# EAGLE design SN65HVD230 (EAGLE 7.2.0)
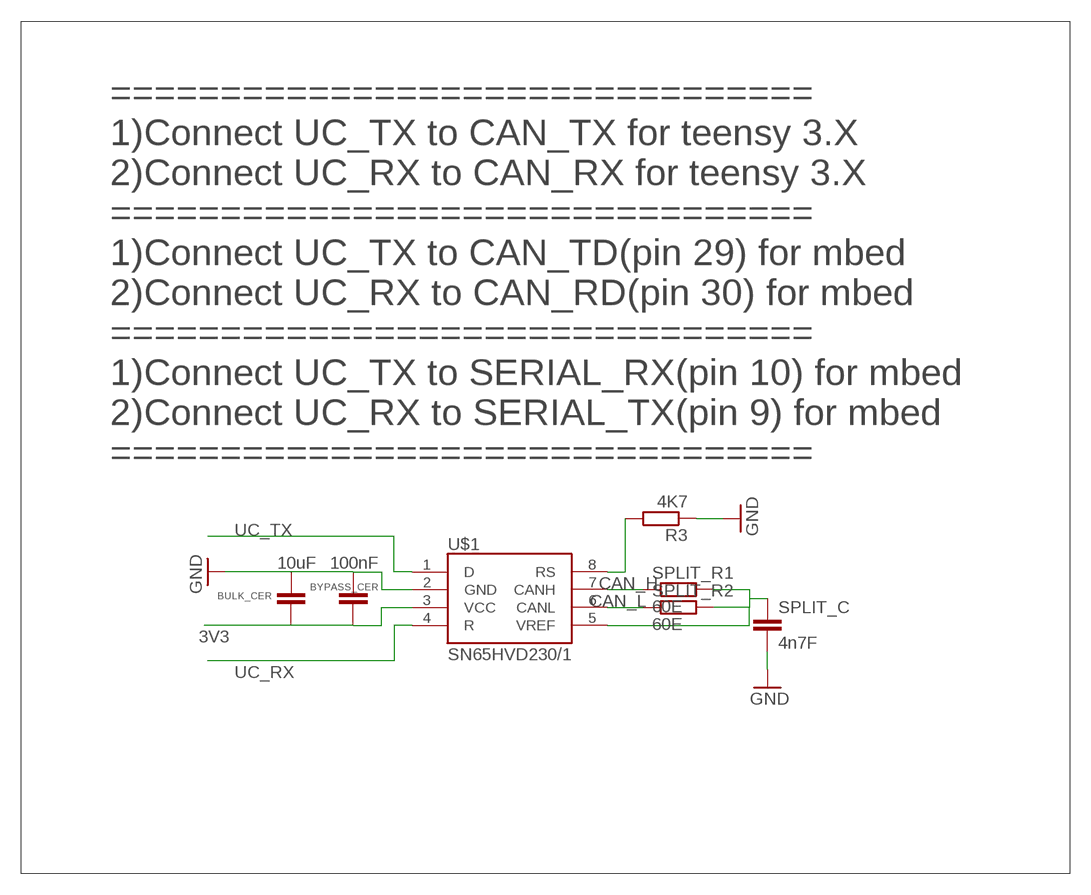
[diagram p0: schematic, sheet 1]

## Parts
BULK_CER  10uF  C-EUC0805  [C0805]
BYPASS_CER  100nF  C-EUC0805  [C0805]
R3  4K7  R-EU_R0805  [R0805]
SPLIT_C  4n7F  C-EUC0805  [C0805]
SPLIT_R1  60E  R-EU_R0805  [R0805]
SPLIT_R2  60E  R-EU_R0805  [R0805]
U$1  SN65HVD230/1  [SO8]

## Nets
3V3: BULK_CER.1 BYPASS_CER.1 U$1.3(VCC)
CAN_H: SPLIT_R1.1 U$1.7(CANH)
CAN_L: SPLIT_R2.1 U$1.6(CANL)
GND: BULK_CER.2 BYPASS_CER.2 R3.1 SPLIT_C.2 U$1.2(GND)
N$5: R3.2 U$1.8(RS)
N$9: SPLIT_C.1 SPLIT_R1.2 SPLIT_R2.2 U$1.5(VREF)
UC_RX: U$1.4(R)
UC_TX: U$1.1(D)

## Notes on the sheet
- ================================
  1)Connect UC_TX to CAN_TX for teensy 3.X
  2)Connect UC_RX to CAN_RX for teensy 3.X
  ================================
  1)Connect UC_TX to CAN_TD(pin 29) for mbed
  2)Connect UC_RX to CAN_RD(pin 30) for mbed
  ================================
  1)Connect UC_TX to SERIAL_RX(pin 10) for mbed
  2)Connect UC_RX to SERIAL_TX(pin 9) for mbed
  ================================

## Library data of the parts
BULK_CER BYPASS_CER SPLIT_C = LV:C-EU: CAPACITOR, European symbol
R3 SPLIT_R1 SPLIT_R2 = LV:R-EU_: RESISTOR, European symbol
U$1 = texas_1:SN65HVD230/1

## Board
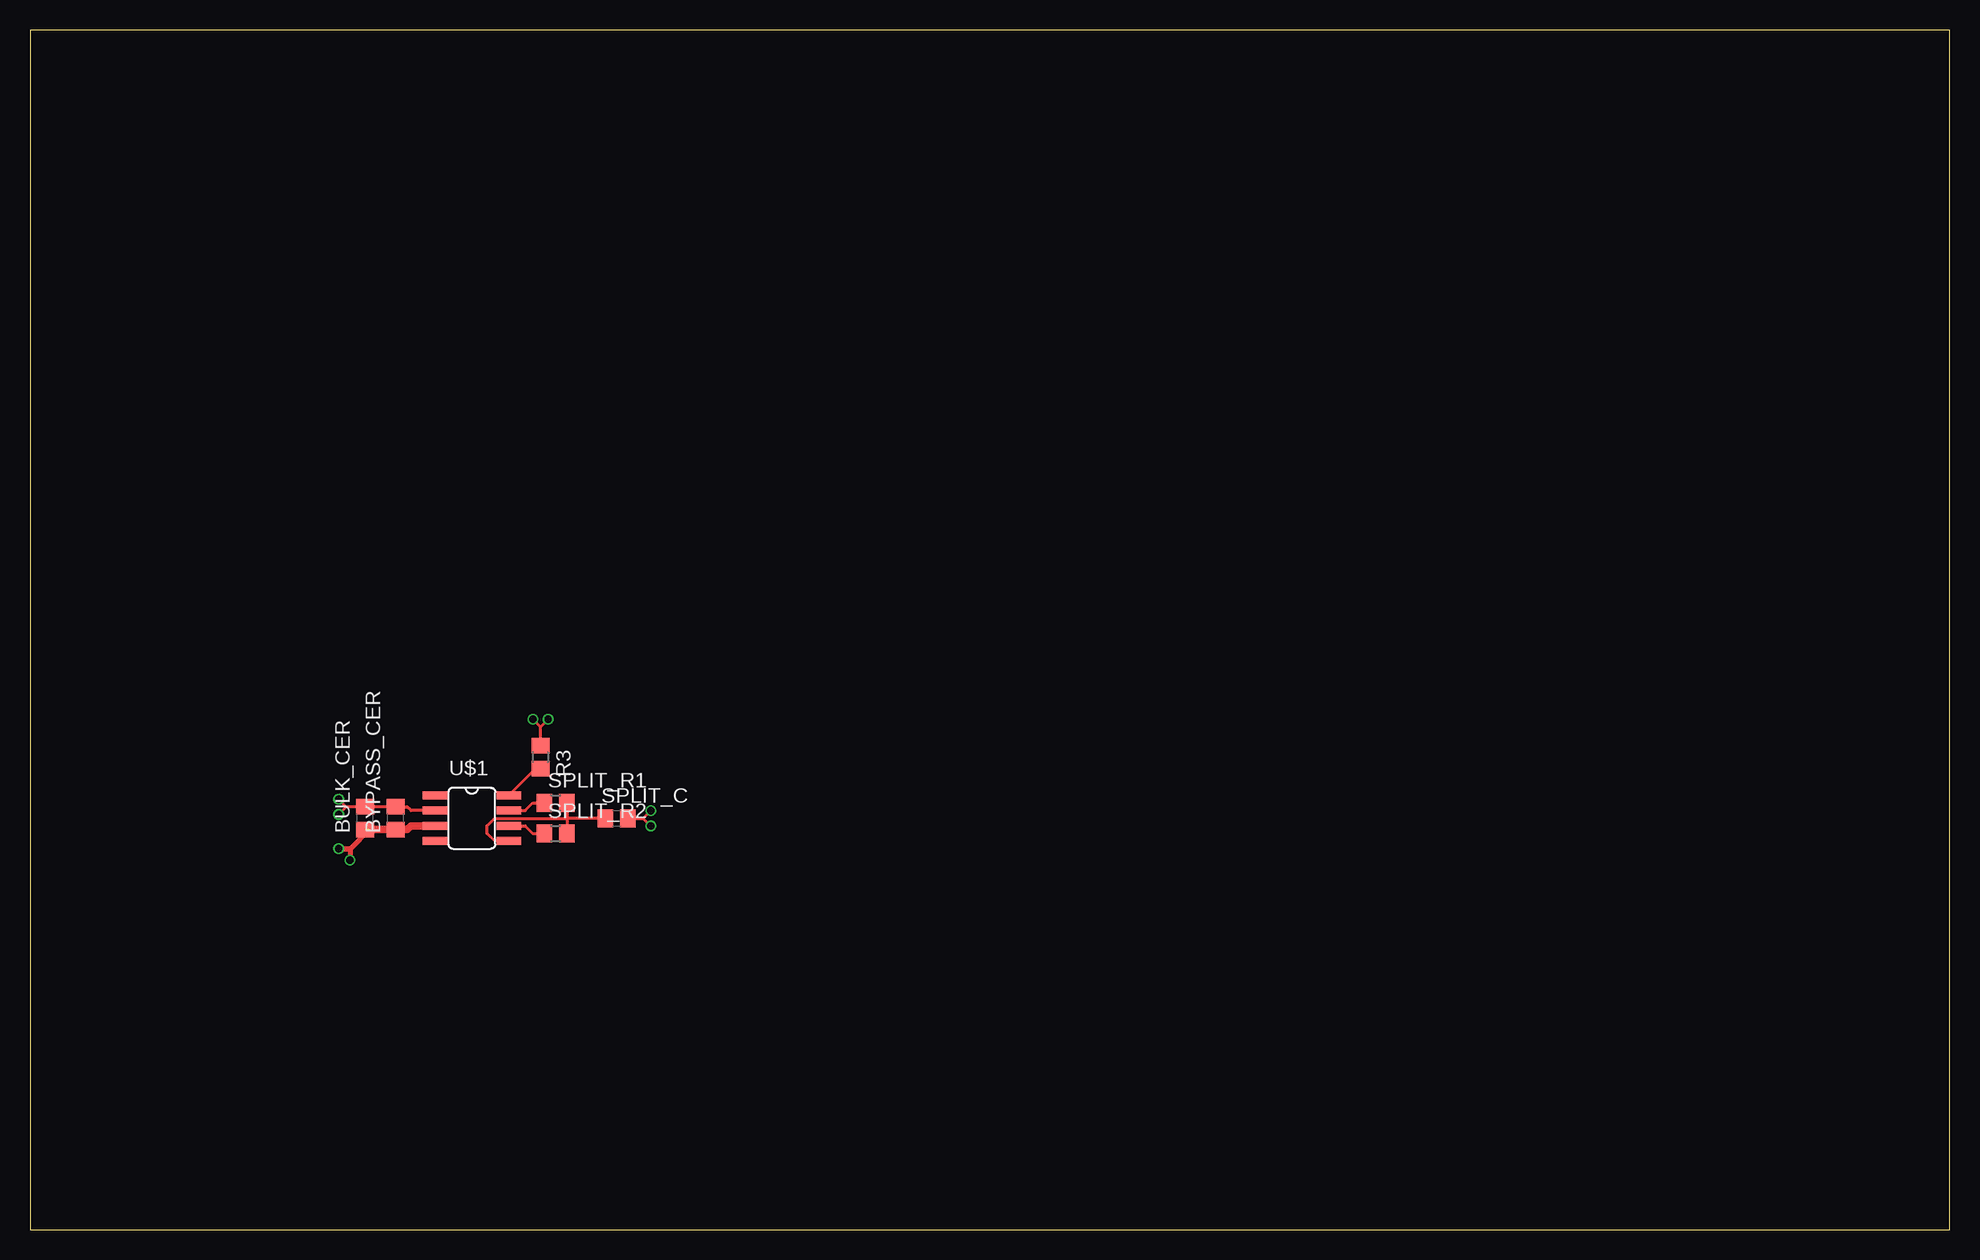
[diagram p1: board, top side]
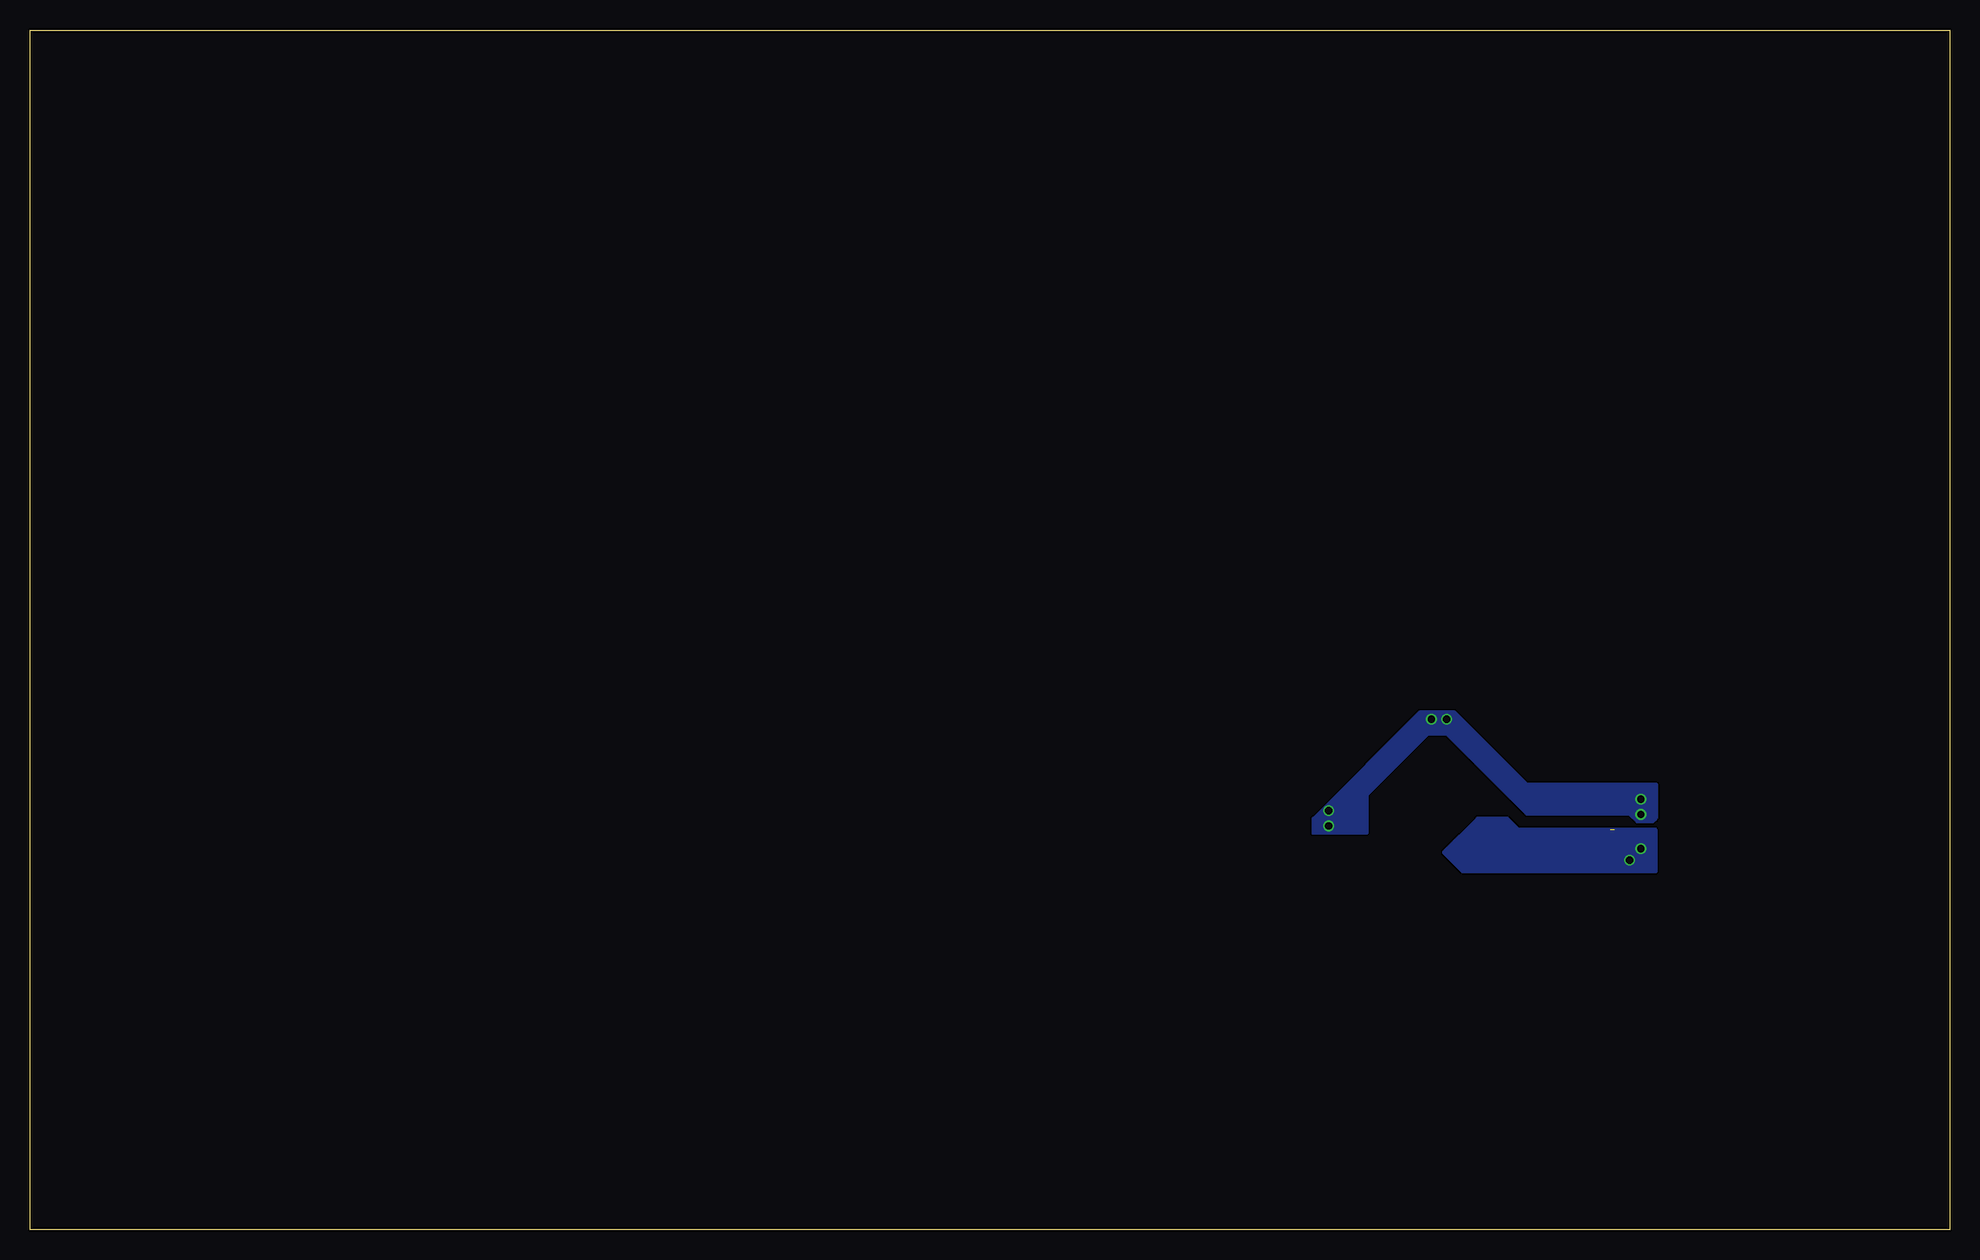
[diagram p2: board, bottom side, seen from below]

Size 160 x 100 mm. Coordinates in mm from the lower left corner, seen from the top.
Outline: 0,0 160,0 160,100 0,100 0,0
Copper layers (1*16): Top 0.035mm / dielectric 1.5mm / Bottom 0.035mm
Design rules "PCB_Power": minimum track width 5mil, minimum drill 10mil, track to track 5mil, track to pad 5mil, pad to pad 5mil, via to via 5mil, smd to smd 5mil, copper to edge 10mil, drill to drill 6mil, minimum pad ring 5mil, minimum via ring 5mil, stop-mask expansion 3mil, vias tented up to drill 0mil, thermal gap 10mil

### Footprints (pad centres in the part's own frame; a part is rotated, then mirrored left to right if it is on the bottom)
C0805 = smd 1.3 x 1.5: 1 -0.95,0; 2 0.95,0
R0805 = smd 1.3 x 1.5: 1 -0.95,0; 2 0.95,0
SO8 = smd 0.66 x 2.032: 1 -1.905,-3.073; 2 -0.635,-3.073; 3 0.635,-3.073; 4 1.905,-3.073; 5 1.905,3.073; 6 0.635,3.073; 7 -0.635,3.073; 8 -1.905,3.073

### Placement (x,y rotation side)
BULK_CER  27.94,34.29 90 top
BYPASS_CER  30.48,34.29 90 top
R3  42.55,39.37 270 top
SPLIT_C  48.9,34.29 0 top
SPLIT_R1  43.81,35.56 0 top
SPLIT_R2  43.81,33.02 0 top
U$1  36.83,34.29 270 top

### Tracks (layer width: path | path; a pad name or v marks a point on that pad's centre or on a via)
3V3  (via drill 0.6)  (1 unrouted)
  Top 0.406: 29.21,33.34 28.26,33.34 26.67,31.75 | 26.67,31.75 v25.72,31.75 26.67,31.75 | 26.67,31.75 v26.67,30.8
  Top 0.635: BULK_CER.1 BYPASS_CER.1 31.43,33.34 31.75,33.66 U$1.3
  pour Bottom: 24.45,33.34 35.88,33.34 36.83,34.29 39.37,34.29 42.23,31.43 40.64,29.84 24.45,29.84
CAN_H
  Top 0.254: U$1.7 41.27,34.92 41.91,35.56 SPLIT_R1.1
CAN_L
  Top 0.254: U$1.6 41.27,33.66 41.91,33.02 SPLIT_R2.1
GND  (via drill 0.6)
  Top 0.254: U$1.2 31.75,34.92 31.43,35.24 BYPASS_CER.2 BULK_CER.2 26.36,35.24 | R3.1 42.55,41.91 | v41.91,42.55 42.55,41.91 | 42.55,41.91 v43.18,42.55 | SPLIT_C.2 51.12,34.29 | v51.75,34.92 51.12,34.29 | 51.12,34.29 v51.75,33.66 | 26.36,35.24 v25.72,35.88 | 26.36,35.24 26.35,35.24 v25.72,34.61
  pour Bottom: 24.45,34.61 34.92,34.61 35.24,34.61 41.91,41.27 43.5,41.27 48.58,36.2 48.58,33.02 53.02,33.02 53.02,34.29 44.13,43.18 41.27,43.18 35.24,37.15 24.45,37.15
  pour Bottom: 24.45,34.61 24.45,34.29 24.77,33.97 26.04,33.97 26.67,34.61 26.35,34.92 24.77,34.92
N$5
  Top 0.254: U$1.8 42.13,38.42 R3.2
N$9
  Top 0.254: SPLIT_R1.2 44.77,34.29 | 44.77,34.29 SPLIT_R2.2 | SPLIT_C.1 44.77,34.29 | U$1.5 38.73,32.38 38.1,33.02 38.1,33.66 38.73,34.29 44.77,34.29